# Altium schematic sheet LED_RGBLight_AD (2).schdoc
size 320 x 250 mm
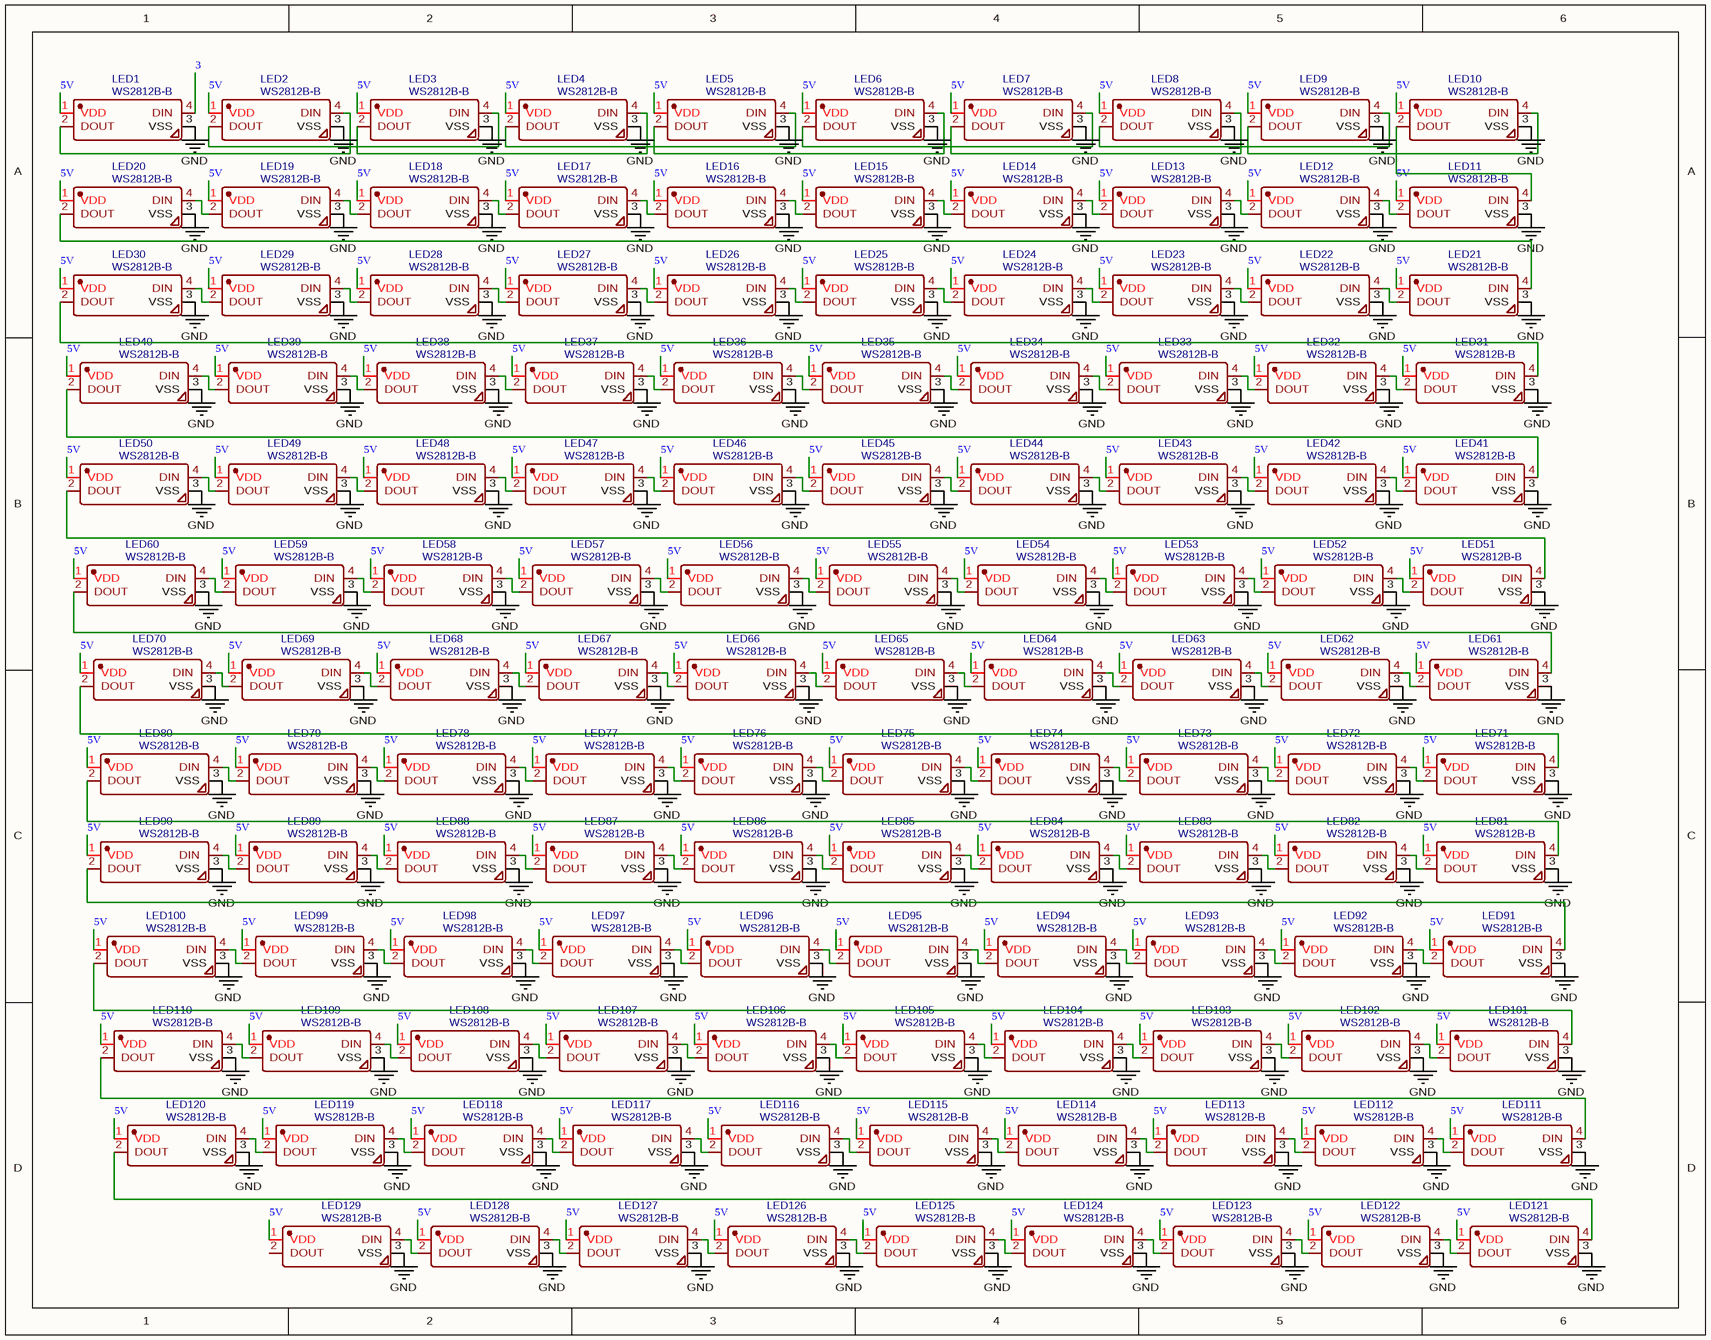
[diagram p0: LED_RGBLight_AD (2).schdoc]

## Parts
LED1  WS2812B-B  [LED-SMD_4P-L5.0-W5.0-TL_WS2812B-B]
LED2  WS2812B-B  [LED-SMD_4P-L5.0-W5.0-TL_WS2812B-B]
LED3  WS2812B-B  [LED-SMD_4P-L5.0-W5.0-TL_WS2812B-B]
LED4  WS2812B-B  [LED-SMD_4P-L5.0-W5.0-TL_WS2812B-B]
LED5  WS2812B-B  [LED-SMD_4P-L5.0-W5.0-TL_WS2812B-B]
LED6  WS2812B-B  [LED-SMD_4P-L5.0-W5.0-TL_WS2812B-B]
LED7  WS2812B-B  [LED-SMD_4P-L5.0-W5.0-TL_WS2812B-B]
LED8  WS2812B-B  [LED-SMD_4P-L5.0-W5.0-TL_WS2812B-B]
LED9  WS2812B-B  [LED-SMD_4P-L5.0-W5.0-TL_WS2812B-B]
LED10  WS2812B-B  [LED-SMD_4P-L5.0-W5.0-TL_WS2812B-B]
LED11  WS2812B-B  [LED-SMD_4P-L5.0-W5.0-TL_WS2812B-B]
LED12  WS2812B-B  [LED-SMD_4P-L5.0-W5.0-TL_WS2812B-B]
LED13  WS2812B-B  [LED-SMD_4P-L5.0-W5.0-TL_WS2812B-B]
LED14  WS2812B-B  [LED-SMD_4P-L5.0-W5.0-TL_WS2812B-B]
LED15  WS2812B-B  [LED-SMD_4P-L5.0-W5.0-TL_WS2812B-B]
LED16  WS2812B-B  [LED-SMD_4P-L5.0-W5.0-TL_WS2812B-B]
LED17  WS2812B-B  [LED-SMD_4P-L5.0-W5.0-TL_WS2812B-B]
LED18  WS2812B-B  [LED-SMD_4P-L5.0-W5.0-TL_WS2812B-B]
LED19  WS2812B-B  [LED-SMD_4P-L5.0-W5.0-TL_WS2812B-B]
LED20  WS2812B-B  [LED-SMD_4P-L5.0-W5.0-TL_WS2812B-B]
LED21  WS2812B-B  [LED-SMD_4P-L5.0-W5.0-TL_WS2812B-B]
LED22  WS2812B-B  [LED-SMD_4P-L5.0-W5.0-TL_WS2812B-B]
LED23  WS2812B-B  [LED-SMD_4P-L5.0-W5.0-TL_WS2812B-B]
LED24  WS2812B-B  [LED-SMD_4P-L5.0-W5.0-TL_WS2812B-B]
LED25  WS2812B-B  [LED-SMD_4P-L5.0-W5.0-TL_WS2812B-B]
LED26  WS2812B-B  [LED-SMD_4P-L5.0-W5.0-TL_WS2812B-B]
LED27  WS2812B-B  [LED-SMD_4P-L5.0-W5.0-TL_WS2812B-B]
LED28  WS2812B-B  [LED-SMD_4P-L5.0-W5.0-TL_WS2812B-B]
LED29  WS2812B-B  [LED-SMD_4P-L5.0-W5.0-TL_WS2812B-B]
LED30  WS2812B-B  [LED-SMD_4P-L5.0-W5.0-TL_WS2812B-B]
LED31  WS2812B-B  [LED-SMD_4P-L5.0-W5.0-TL_WS2812B-B]
LED32  WS2812B-B  [LED-SMD_4P-L5.0-W5.0-TL_WS2812B-B]
LED33  WS2812B-B  [LED-SMD_4P-L5.0-W5.0-TL_WS2812B-B]
LED34  WS2812B-B  [LED-SMD_4P-L5.0-W5.0-TL_WS2812B-B]
LED35  WS2812B-B  [LED-SMD_4P-L5.0-W5.0-TL_WS2812B-B]
LED36  WS2812B-B  [LED-SMD_4P-L5.0-W5.0-TL_WS2812B-B]
LED37  WS2812B-B  [LED-SMD_4P-L5.0-W5.0-TL_WS2812B-B]
LED38  WS2812B-B  [LED-SMD_4P-L5.0-W5.0-TL_WS2812B-B]
LED39  WS2812B-B  [LED-SMD_4P-L5.0-W5.0-TL_WS2812B-B]
LED40  WS2812B-B  [LED-SMD_4P-L5.0-W5.0-TL_WS2812B-B]
LED41  WS2812B-B  [LED-SMD_4P-L5.0-W5.0-TL_WS2812B-B]
LED42  WS2812B-B  [LED-SMD_4P-L5.0-W5.0-TL_WS2812B-B]
LED43  WS2812B-B  [LED-SMD_4P-L5.0-W5.0-TL_WS2812B-B]
LED44  WS2812B-B  [LED-SMD_4P-L5.0-W5.0-TL_WS2812B-B]
LED45  WS2812B-B  [LED-SMD_4P-L5.0-W5.0-TL_WS2812B-B]
LED46  WS2812B-B  [LED-SMD_4P-L5.0-W5.0-TL_WS2812B-B]
LED47  WS2812B-B  [LED-SMD_4P-L5.0-W5.0-TL_WS2812B-B]
LED48  WS2812B-B  [LED-SMD_4P-L5.0-W5.0-TL_WS2812B-B]
LED49  WS2812B-B  [LED-SMD_4P-L5.0-W5.0-TL_WS2812B-B]
LED50  WS2812B-B  [LED-SMD_4P-L5.0-W5.0-TL_WS2812B-B]
LED51  WS2812B-B  [LED-SMD_4P-L5.0-W5.0-TL_WS2812B-B]
LED52  WS2812B-B  [LED-SMD_4P-L5.0-W5.0-TL_WS2812B-B]
LED53  WS2812B-B  [LED-SMD_4P-L5.0-W5.0-TL_WS2812B-B]
LED54  WS2812B-B  [LED-SMD_4P-L5.0-W5.0-TL_WS2812B-B]
LED55  WS2812B-B  [LED-SMD_4P-L5.0-W5.0-TL_WS2812B-B]
LED56  WS2812B-B  [LED-SMD_4P-L5.0-W5.0-TL_WS2812B-B]
LED57  WS2812B-B  [LED-SMD_4P-L5.0-W5.0-TL_WS2812B-B]
LED58  WS2812B-B  [LED-SMD_4P-L5.0-W5.0-TL_WS2812B-B]
LED59  WS2812B-B  [LED-SMD_4P-L5.0-W5.0-TL_WS2812B-B]
LED60  WS2812B-B  [LED-SMD_4P-L5.0-W5.0-TL_WS2812B-B]
LED61  WS2812B-B  [LED-SMD_4P-L5.0-W5.0-TL_WS2812B-B]
LED62  WS2812B-B  [LED-SMD_4P-L5.0-W5.0-TL_WS2812B-B]
LED63  WS2812B-B  [LED-SMD_4P-L5.0-W5.0-TL_WS2812B-B]
LED64  WS2812B-B  [LED-SMD_4P-L5.0-W5.0-TL_WS2812B-B]
LED65  WS2812B-B  [LED-SMD_4P-L5.0-W5.0-TL_WS2812B-B]
LED66  WS2812B-B  [LED-SMD_4P-L5.0-W5.0-TL_WS2812B-B]
LED67  WS2812B-B  [LED-SMD_4P-L5.0-W5.0-TL_WS2812B-B]
LED68  WS2812B-B  [LED-SMD_4P-L5.0-W5.0-TL_WS2812B-B]
LED69  WS2812B-B  [LED-SMD_4P-L5.0-W5.0-TL_WS2812B-B]
LED70  WS2812B-B  [LED-SMD_4P-L5.0-W5.0-TL_WS2812B-B]
LED71  WS2812B-B  [LED-SMD_4P-L5.0-W5.0-TL_WS2812B-B]
LED72  WS2812B-B  [LED-SMD_4P-L5.0-W5.0-TL_WS2812B-B]
LED73  WS2812B-B  [LED-SMD_4P-L5.0-W5.0-TL_WS2812B-B]
LED74  WS2812B-B  [LED-SMD_4P-L5.0-W5.0-TL_WS2812B-B]
LED75  WS2812B-B  [LED-SMD_4P-L5.0-W5.0-TL_WS2812B-B]
LED76  WS2812B-B  [LED-SMD_4P-L5.0-W5.0-TL_WS2812B-B]
LED77  WS2812B-B  [LED-SMD_4P-L5.0-W5.0-TL_WS2812B-B]
LED78  WS2812B-B  [LED-SMD_4P-L5.0-W5.0-TL_WS2812B-B]
LED79  WS2812B-B  [LED-SMD_4P-L5.0-W5.0-TL_WS2812B-B]
LED80  WS2812B-B  [LED-SMD_4P-L5.0-W5.0-TL_WS2812B-B]
LED81  WS2812B-B  [LED-SMD_4P-L5.0-W5.0-TL_WS2812B-B]
LED82  WS2812B-B  [LED-SMD_4P-L5.0-W5.0-TL_WS2812B-B]
LED83  WS2812B-B  [LED-SMD_4P-L5.0-W5.0-TL_WS2812B-B]
LED84  WS2812B-B  [LED-SMD_4P-L5.0-W5.0-TL_WS2812B-B]
LED85  WS2812B-B  [LED-SMD_4P-L5.0-W5.0-TL_WS2812B-B]
LED86  WS2812B-B  [LED-SMD_4P-L5.0-W5.0-TL_WS2812B-B]
LED87  WS2812B-B  [LED-SMD_4P-L5.0-W5.0-TL_WS2812B-B]
LED88  WS2812B-B  [LED-SMD_4P-L5.0-W5.0-TL_WS2812B-B]
LED89  WS2812B-B  [LED-SMD_4P-L5.0-W5.0-TL_WS2812B-B]
LED90  WS2812B-B  [LED-SMD_4P-L5.0-W5.0-TL_WS2812B-B]
LED91  WS2812B-B  [LED-SMD_4P-L5.0-W5.0-TL_WS2812B-B]
LED92  WS2812B-B  [LED-SMD_4P-L5.0-W5.0-TL_WS2812B-B]
LED93  WS2812B-B  [LED-SMD_4P-L5.0-W5.0-TL_WS2812B-B]
LED94  WS2812B-B  [LED-SMD_4P-L5.0-W5.0-TL_WS2812B-B]
LED95  WS2812B-B  [LED-SMD_4P-L5.0-W5.0-TL_WS2812B-B]
LED96  WS2812B-B  [LED-SMD_4P-L5.0-W5.0-TL_WS2812B-B]
LED97  WS2812B-B  [LED-SMD_4P-L5.0-W5.0-TL_WS2812B-B]
LED98  WS2812B-B  [LED-SMD_4P-L5.0-W5.0-TL_WS2812B-B]
LED99  WS2812B-B  [LED-SMD_4P-L5.0-W5.0-TL_WS2812B-B]
LED100  WS2812B-B  [LED-SMD_4P-L5.0-W5.0-TL_WS2812B-B]
LED101  WS2812B-B  [LED-SMD_4P-L5.0-W5.0-TL_WS2812B-B]
LED102  WS2812B-B  [LED-SMD_4P-L5.0-W5.0-TL_WS2812B-B]
LED103  WS2812B-B  [LED-SMD_4P-L5.0-W5.0-TL_WS2812B-B]
LED104  WS2812B-B  [LED-SMD_4P-L5.0-W5.0-TL_WS2812B-B]
LED105  WS2812B-B  [LED-SMD_4P-L5.0-W5.0-TL_WS2812B-B]
LED106  WS2812B-B  [LED-SMD_4P-L5.0-W5.0-TL_WS2812B-B]
LED107  WS2812B-B  [LED-SMD_4P-L5.0-W5.0-TL_WS2812B-B]
LED108  WS2812B-B  [LED-SMD_4P-L5.0-W5.0-TL_WS2812B-B]
LED109  WS2812B-B  [LED-SMD_4P-L5.0-W5.0-TL_WS2812B-B]
LED110  WS2812B-B  [LED-SMD_4P-L5.0-W5.0-TL_WS2812B-B]
LED111  WS2812B-B  [LED-SMD_4P-L5.0-W5.0-TL_WS2812B-B]
LED112  WS2812B-B  [LED-SMD_4P-L5.0-W5.0-TL_WS2812B-B]
LED113  WS2812B-B  [LED-SMD_4P-L5.0-W5.0-TL_WS2812B-B]
LED114  WS2812B-B  [LED-SMD_4P-L5.0-W5.0-TL_WS2812B-B]
LED115  WS2812B-B  [LED-SMD_4P-L5.0-W5.0-TL_WS2812B-B]
LED116  WS2812B-B  [LED-SMD_4P-L5.0-W5.0-TL_WS2812B-B]
LED117  WS2812B-B  [LED-SMD_4P-L5.0-W5.0-TL_WS2812B-B]
LED118  WS2812B-B  [LED-SMD_4P-L5.0-W5.0-TL_WS2812B-B]
LED119  WS2812B-B  [LED-SMD_4P-L5.0-W5.0-TL_WS2812B-B]
LED120  WS2812B-B  [LED-SMD_4P-L5.0-W5.0-TL_WS2812B-B]
LED121  WS2812B-B  [LED-SMD_4P-L5.0-W5.0-TL_WS2812B-B]
LED122  WS2812B-B  [LED-SMD_4P-L5.0-W5.0-TL_WS2812B-B]
LED123  WS2812B-B  [LED-SMD_4P-L5.0-W5.0-TL_WS2812B-B]
LED124  WS2812B-B  [LED-SMD_4P-L5.0-W5.0-TL_WS2812B-B]
LED125  WS2812B-B  [LED-SMD_4P-L5.0-W5.0-TL_WS2812B-B]
LED126  WS2812B-B  [LED-SMD_4P-L5.0-W5.0-TL_WS2812B-B]
LED127  WS2812B-B  [LED-SMD_4P-L5.0-W5.0-TL_WS2812B-B]
LED128  WS2812B-B  [LED-SMD_4P-L5.0-W5.0-TL_WS2812B-B]
LED129  WS2812B-B  [LED-SMD_4P-L5.0-W5.0-TL_WS2812B-B]

## Nets
GND: LED1.3(VSS) LED2.3(VSS) LED3.3(VSS) LED4.3(VSS) LED5.3(VSS) LED6.3(VSS) LED7.3(VSS) LED8.3(VSS) LED9.3(VSS) LED10.3(VSS) LED11.3(VSS) LED12.3(VSS) LED13.3(VSS) LED14.3(VSS) LED15.3(VSS) LED16.3(VSS) LED17.3(VSS) LED18.3(VSS) LED19.3(VSS) LED20.3(VSS) LED21.3(VSS) LED22.3(VSS) LED23.3(VSS) LED24.3(VSS) LED25.3(VSS) LED26.3(VSS) LED27.3(VSS) LED28.3(VSS) LED29.3(VSS) LED30.3(VSS) LED31.3(VSS) LED32.3(VSS) LED33.3(VSS) LED34.3(VSS) LED35.3(VSS) LED36.3(VSS) LED37.3(VSS) LED38.3(VSS) LED39.3(VSS) LED40.3(VSS) LED41.3(VSS) LED42.3(VSS) LED43.3(VSS) LED44.3(VSS) LED45.3(VSS) LED46.3(VSS) LED47.3(VSS) LED48.3(VSS) LED49.3(VSS) LED50.3(VSS) LED51.3(VSS) LED52.3(VSS) LED53.3(VSS) LED54.3(VSS) LED55.3(VSS) LED56.3(VSS) LED57.3(VSS) LED58.3(VSS) LED59.3(VSS) LED60.3(VSS) LED61.3(VSS) LED62.3(VSS) LED63.3(VSS) LED64.3(VSS) LED65.3(VSS) LED66.3(VSS) LED67.3(VSS) LED68.3(VSS) LED69.3(VSS) LED70.3(VSS) LED71.3(VSS) LED72.3(VSS) LED73.3(VSS) LED74.3(VSS) LED75.3(VSS) LED76.3(VSS) LED77.3(VSS) LED78.3(VSS) LED79.3(VSS) LED80.3(VSS) LED81.3(VSS) LED82.3(VSS) LED83.3(VSS) LED84.3(VSS) LED85.3(VSS) LED86.3(VSS) LED87.3(VSS) LED88.3(VSS) LED89.3(VSS) LED90.3(VSS) LED91.3(VSS) LED92.3(VSS) LED93.3(VSS) LED94.3(VSS) LED95.3(VSS) LED96.3(VSS) LED97.3(VSS) LED98.3(VSS) LED99.3(VSS) LED100.3(VSS) LED101.3(VSS) LED102.3(VSS) LED103.3(VSS) LED104.3(VSS) LED105.3(VSS) LED106.3(VSS) LED107.3(VSS) LED108.3(VSS) LED109.3(VSS) LED110.3(VSS) LED111.3(VSS) LED112.3(VSS) LED113.3(VSS) LED114.3(VSS) LED115.3(VSS) LED116.3(VSS) LED117.3(VSS) LED118.3(VSS) LED119.3(VSS) LED120.3(VSS) LED121.3(VSS) LED122.3(VSS) LED123.3(VSS) LED124.3(VSS) LED125.3(VSS) LED126.3(VSS) LED127.3(VSS) LED128.3(VSS) LED129.3(VSS)
3: LED1.4(DIN)
5V: LED1.1(VDD) LED2.1(VDD) LED3.1(VDD) LED4.1(VDD) LED5.1(VDD) LED6.1(VDD) LED7.1(VDD) LED8.1(VDD) LED9.1(VDD) LED10.1(VDD) LED11.1(VDD) LED12.1(VDD) LED13.1(VDD) LED14.1(VDD) LED15.1(VDD) LED16.1(VDD) LED17.1(VDD) LED18.1(VDD) LED19.1(VDD) LED20.1(VDD) LED21.1(VDD) LED22.1(VDD) LED23.1(VDD) LED24.1(VDD) LED25.1(VDD) LED26.1(VDD) LED27.1(VDD) LED28.1(VDD) LED29.1(VDD) LED30.1(VDD) LED31.1(VDD) LED32.1(VDD) LED33.1(VDD) LED34.1(VDD) LED35.1(VDD) LED36.1(VDD) LED37.1(VDD) LED38.1(VDD) LED39.1(VDD) LED40.1(VDD) LED41.1(VDD) LED42.1(VDD) LED43.1(VDD) LED44.1(VDD) LED45.1(VDD) LED46.1(VDD) LED47.1(VDD) LED48.1(VDD) LED49.1(VDD) LED50.1(VDD) LED51.1(VDD) LED52.1(VDD) LED53.1(VDD) LED54.1(VDD) LED55.1(VDD) LED56.1(VDD) LED57.1(VDD) LED58.1(VDD) LED59.1(VDD) LED60.1(VDD) LED61.1(VDD) LED62.1(VDD) LED63.1(VDD) LED64.1(VDD) LED65.1(VDD) LED66.1(VDD) LED67.1(VDD) LED68.1(VDD) LED69.1(VDD) LED70.1(VDD) LED71.1(VDD) LED72.1(VDD) LED73.1(VDD) LED74.1(VDD) LED75.1(VDD) LED76.1(VDD) LED77.1(VDD) LED78.1(VDD) LED79.1(VDD) LED80.1(VDD) LED81.1(VDD) LED82.1(VDD) LED83.1(VDD) LED84.1(VDD) LED85.1(VDD) LED86.1(VDD) LED87.1(VDD) LED88.1(VDD) LED89.1(VDD) LED90.1(VDD) LED91.1(VDD) LED92.1(VDD) LED93.1(VDD) LED94.1(VDD) LED95.1(VDD) LED96.1(VDD) LED97.1(VDD) LED98.1(VDD) LED99.1(VDD) LED100.1(VDD) LED101.1(VDD) LED102.1(VDD) LED103.1(VDD) LED104.1(VDD) LED105.1(VDD) LED106.1(VDD) LED107.1(VDD) LED108.1(VDD) LED109.1(VDD) LED110.1(VDD) LED111.1(VDD) LED112.1(VDD) LED113.1(VDD) LED114.1(VDD) LED115.1(VDD) LED116.1(VDD) LED117.1(VDD) LED118.1(VDD) LED119.1(VDD) LED120.1(VDD) LED121.1(VDD) LED122.1(VDD) LED123.1(VDD) LED124.1(VDD) LED125.1(VDD) LED126.1(VDD) LED127.1(VDD) LED128.1(VDD) LED129.1(VDD)
NetLED1_2: LED1.2(DOUT) LED2.4(DIN)
NetLED2_2: LED2.2(DOUT) LED3.4(DIN)
NetLED3_2: LED3.2(DOUT) LED4.4(DIN)
NetLED4_2: LED4.2(DOUT) LED5.4(DIN)
NetLED5_2: LED5.2(DOUT) LED6.4(DIN)
NetLED6_2: LED6.2(DOUT) LED7.4(DIN)
NetLED7_2: LED7.2(DOUT) LED8.4(DIN)
NetLED8_2: LED8.2(DOUT) LED9.4(DIN)
NetLED9_2: LED9.2(DOUT) LED10.4(DIN)
NetLED10_2: LED10.2(DOUT) LED11.4(DIN)
NetLED11_2: LED11.2(DOUT) LED12.4(DIN)
NetLED12_2: LED12.2(DOUT) LED13.4(DIN)
NetLED13_2: LED13.2(DOUT) LED14.4(DIN)
NetLED14_2: LED14.2(DOUT) LED15.4(DIN)
NetLED15_2: LED15.2(DOUT) LED16.4(DIN)
NetLED16_2: LED16.2(DOUT) LED17.4(DIN)
NetLED17_2: LED17.2(DOUT) LED18.4(DIN)
NetLED18_2: LED18.2(DOUT) LED19.4(DIN)
NetLED19_2: LED19.2(DOUT) LED20.4(DIN)
NetLED20_2: LED20.2(DOUT) LED21.4(DIN)
NetLED21_2: LED21.2(DOUT) LED22.4(DIN)
NetLED22_2: LED22.2(DOUT) LED23.4(DIN)
NetLED23_2: LED23.2(DOUT) LED24.4(DIN)
NetLED24_2: LED24.2(DOUT) LED25.4(DIN)
NetLED25_2: LED25.2(DOUT) LED26.4(DIN)
NetLED26_2: LED26.2(DOUT) LED27.4(DIN)
NetLED27_2: LED27.2(DOUT) LED28.4(DIN)
NetLED28_2: LED28.2(DOUT) LED29.4(DIN)
NetLED29_2: LED29.2(DOUT) LED30.4(DIN)
NetLED30_2: LED30.2(DOUT) LED31.4(DIN)
NetLED31_2: LED31.2(DOUT) LED32.4(DIN)
NetLED32_2: LED32.2(DOUT) LED33.4(DIN)
NetLED33_2: LED33.2(DOUT) LED34.4(DIN)
NetLED34_2: LED34.2(DOUT) LED35.4(DIN)
NetLED35_2: LED35.2(DOUT) LED36.4(DIN)
NetLED36_2: LED36.2(DOUT) LED37.4(DIN)
NetLED37_2: LED37.2(DOUT) LED38.4(DIN)
NetLED38_2: LED38.2(DOUT) LED39.4(DIN)
NetLED39_2: LED39.2(DOUT) LED40.4(DIN)
NetLED40_2: LED40.2(DOUT) LED41.4(DIN)
NetLED41_2: LED41.2(DOUT) LED42.4(DIN)
NetLED42_2: LED42.2(DOUT) LED43.4(DIN)
NetLED43_2: LED43.2(DOUT) LED44.4(DIN)
NetLED44_2: LED44.2(DOUT) LED45.4(DIN)
NetLED45_2: LED45.2(DOUT) LED46.4(DIN)
NetLED46_2: LED46.2(DOUT) LED47.4(DIN)
NetLED47_2: LED47.2(DOUT) LED48.4(DIN)
NetLED48_2: LED48.2(DOUT) LED49.4(DIN)
NetLED49_2: LED49.2(DOUT) LED50.4(DIN)
NetLED50_2: LED50.2(DOUT) LED51.4(DIN)
NetLED51_2: LED51.2(DOUT) LED52.4(DIN)
NetLED52_2: LED52.2(DOUT) LED53.4(DIN)
NetLED53_2: LED53.2(DOUT) LED54.4(DIN)
NetLED54_2: LED54.2(DOUT) LED55.4(DIN)
NetLED55_2: LED55.2(DOUT) LED56.4(DIN)
NetLED56_2: LED56.2(DOUT) LED57.4(DIN)
NetLED57_2: LED57.2(DOUT) LED58.4(DIN)
NetLED58_2: LED58.2(DOUT) LED59.4(DIN)
NetLED59_2: LED59.2(DOUT) LED60.4(DIN)
NetLED60_2: LED60.2(DOUT) LED61.4(DIN)
NetLED61_2: LED61.2(DOUT) LED62.4(DIN)
NetLED62_2: LED62.2(DOUT) LED63.4(DIN)
NetLED63_2: LED63.2(DOUT) LED64.4(DIN)
NetLED64_2: LED64.2(DOUT) LED65.4(DIN)
NetLED65_2: LED65.2(DOUT) LED66.4(DIN)
NetLED66_2: LED66.2(DOUT) LED67.4(DIN)
NetLED67_2: LED67.2(DOUT) LED68.4(DIN)
NetLED68_2: LED68.2(DOUT) LED69.4(DIN)
NetLED69_2: LED69.2(DOUT) LED70.4(DIN)
NetLED70_2: LED70.2(DOUT) LED71.4(DIN)
NetLED71_2: LED71.2(DOUT) LED72.4(DIN)
NetLED72_2: LED72.2(DOUT) LED73.4(DIN)
NetLED73_2: LED73.2(DOUT) LED74.4(DIN)
NetLED74_2: LED74.2(DOUT) LED75.4(DIN)
NetLED75_2: LED75.2(DOUT) LED76.4(DIN)
NetLED76_2: LED76.2(DOUT) LED77.4(DIN)
NetLED77_2: LED77.2(DOUT) LED78.4(DIN)
NetLED78_2: LED78.2(DOUT) LED79.4(DIN)
NetLED79_2: LED79.2(DOUT) LED80.4(DIN)
NetLED80_2: LED80.2(DOUT) LED81.4(DIN)
NetLED81_2: LED81.2(DOUT) LED82.4(DIN)
NetLED82_2: LED82.2(DOUT) LED83.4(DIN)
NetLED83_2: LED83.2(DOUT) LED84.4(DIN)
NetLED84_2: LED84.2(DOUT) LED85.4(DIN)
NetLED85_2: LED85.2(DOUT) LED86.4(DIN)
NetLED86_2: LED86.2(DOUT) LED87.4(DIN)
NetLED87_2: LED87.2(DOUT) LED88.4(DIN)
NetLED88_2: LED88.2(DOUT) LED89.4(DIN)
NetLED89_2: LED89.2(DOUT) LED90.4(DIN)
NetLED90_2: LED90.2(DOUT) LED91.4(DIN)
NetLED91_2: LED91.2(DOUT) LED92.4(DIN)
NetLED92_2: LED92.2(DOUT) LED93.4(DIN)
NetLED93_2: LED93.2(DOUT) LED94.4(DIN)
NetLED94_2: LED94.2(DOUT) LED95.4(DIN)
NetLED95_2: LED95.2(DOUT) LED96.4(DIN)
NetLED96_2: LED96.2(DOUT) LED97.4(DIN)
NetLED97_2: LED97.2(DOUT) LED98.4(DIN)
NetLED98_2: LED98.2(DOUT) LED99.4(DIN)
NetLED99_2: LED99.2(DOUT) LED100.4(DIN)
NetLED100_2: LED100.2(DOUT) LED101.4(DIN)
NetLED101_2: LED101.2(DOUT) LED102.4(DIN)
NetLED102_2: LED102.2(DOUT) LED103.4(DIN)
NetLED103_2: LED103.2(DOUT) LED104.4(DIN)
NetLED104_2: LED104.2(DOUT) LED105.4(DIN)
NetLED105_2: LED105.2(DOUT) LED106.4(DIN)
NetLED106_2: LED106.2(DOUT) LED107.4(DIN)
NetLED107_2: LED107.2(DOUT) LED108.4(DIN)
NetLED108_2: LED108.2(DOUT) LED109.4(DIN)
NetLED109_2: LED109.2(DOUT) LED110.4(DIN)
NetLED110_2: LED110.2(DOUT) LED111.4(DIN)
NetLED111_2: LED111.2(DOUT) LED112.4(DIN)
NetLED112_2: LED112.2(DOUT) LED113.4(DIN)
NetLED113_2: LED113.2(DOUT) LED114.4(DIN)
NetLED114_2: LED114.2(DOUT) LED115.4(DIN)
NetLED115_2: LED115.2(DOUT) LED116.4(DIN)
NetLED116_2: LED116.2(DOUT) LED117.4(DIN)
NetLED117_2: LED117.2(DOUT) LED118.4(DIN)
NetLED118_2: LED118.2(DOUT) LED119.4(DIN)
NetLED119_2: LED119.2(DOUT) LED120.4(DIN)
NetLED120_2: LED120.2(DOUT) LED121.4(DIN)
NetLED121_2: LED121.2(DOUT) LED122.4(DIN)
NetLED122_2: LED122.2(DOUT) LED123.4(DIN)
NetLED123_2: LED123.2(DOUT) LED124.4(DIN)
NetLED124_2: LED124.2(DOUT) LED125.4(DIN)
NetLED125_2: LED125.2(DOUT) LED126.4(DIN)
NetLED126_2: LED126.2(DOUT) LED127.4(DIN)
NetLED127_2: LED127.2(DOUT) LED128.4(DIN)
NetLED128_2: LED128.2(DOUT) LED129.4(DIN)

Not connected (* = marked no-connect by the designer): LED129 2(DOUT)

## Library data of the parts
LED1-LED129 = WS2812B-B: BOM_Manufacturer: Worldsemi; Contributor: LCSC; BOM_Supplier: LCSC; BOM_Manufacturer Part: WS2812B-B; BOM_Supplier Part: C114586; BOM_JLCPCB Part Class: Extended Part; spicePre: L; spiceSymbolName: WS2812B-B